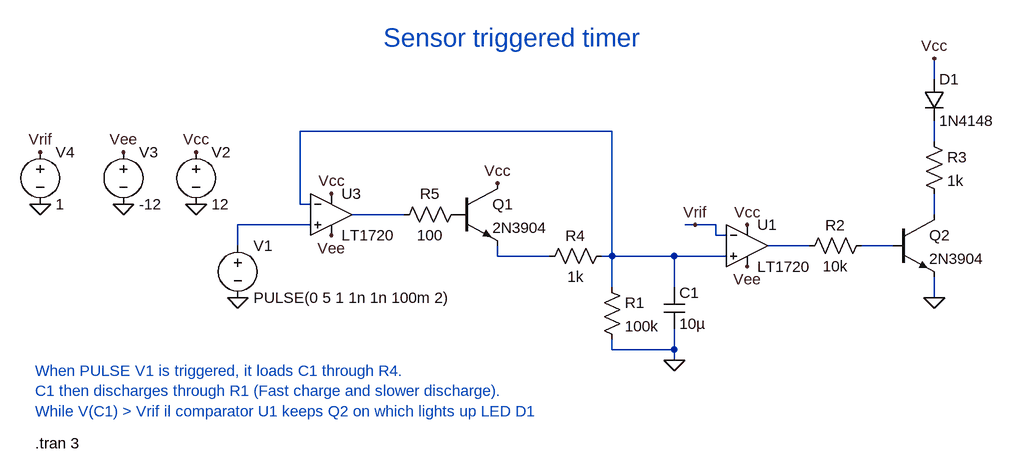
[diagram p0: schematic Sensor-triggered-timer-temporizzatore-1.asc]
Sensor-triggered-timer-temporizzatore-1.asc, the LTspice schematic file:
Version 4
SHEET 1 1152 680
WIRE 1056 -112 1056 -144
WIRE 560 -32 80 -32
WIRE 1056 -16 1056 -48
WIRE 80 80 80 -32
WIRE 96 80 80 80
WIRE 240 96 160 96
WIRE 1056 96 1056 64
WIRE 96 112 -16 112
WIRE 688 112 672 112
WIRE 720 112 688 112
WIRE 720 128 720 112
WIRE 736 128 720 128
WIRE -16 144 -16 112
WIRE 864 144 800 144
WIRE 992 144 944 144
WIRE 384 160 384 144
WIRE 464 160 384 160
WIRE 560 160 560 -32
WIRE 560 160 544 160
WIRE 656 160 560 160
WIRE 736 160 656 160
WIRE 560 208 560 160
WIRE 656 208 656 160
WIRE 1056 224 1056 192
WIRE 560 304 560 288
WIRE 656 304 656 272
WIRE 656 304 560 304
WIRE 656 320 656 304
FLAG 656 320 0
FLAG -16 224 0
FLAG -80 80 0
FLAG -80 0 Vcc
FLAG 128 64 Vcc
FLAG 384 48 Vcc
FLAG 768 112 Vcc
FLAG 1056 224 0
FLAG 1056 -144 Vcc
FLAG -192 80 0
FLAG -192 0 Vee
FLAG 128 128 Vee
FLAG 768 176 Vee
FLAG -320 80 0
FLAG 688 112 Vrif
FLAG -320 0 Vrif
SYMBOL voltage -16 128 R0
WINDOW 123 0 0 Left 2
WINDOW 39 0 0 Left 2
SYMATTR InstName V1
SYMATTR Value PULSE(0 5 1 1n 1n 100m 2)
SYMBOL npn 320 48 R0
SYMATTR InstName Q1
SYMATTR Value 2N3904
SYMBOL res 544 192 R0
SYMATTR InstName R1
SYMATTR Value 100k
SYMBOL cap 640 208 R0
SYMATTR InstName C1
SYMATTR Value 10µ
SYMBOL voltage -80 -16 R0
WINDOW 123 0 0 Left 2
WINDOW 39 0 0 Left 2
SYMATTR InstName V2
SYMATTR Value 12
SYMBOL res 960 128 R90
WINDOW 0 0 56 VBottom 2
WINDOW 3 32 56 VTop 2
SYMATTR InstName R2
SYMATTR Value 10k
SYMBOL npn 992 96 R0
SYMATTR InstName Q2
SYMATTR Value 2N3904
SYMBOL res 1040 -32 R0
SYMATTR InstName R3
SYMATTR Value 1k
SYMBOL diode 1040 -112 R0
SYMATTR InstName D1
SYMATTR Value 1N4148
SYMBOL res 560 144 R90
WINDOW 0 0 56 VBottom 2
WINDOW 3 32 56 VTop 2
SYMATTR InstName R4
SYMATTR Value 1k
SYMBOL res 336 80 R90
WINDOW 0 0 56 VBottom 2
WINDOW 3 32 56 VTop 2
SYMATTR InstName R5
SYMATTR Value 100
SYMBOL Comparators\\LT1720 128 32 R0
SYMATTR InstName U3
SYMBOL voltage -192 -16 R0
WINDOW 123 0 0 Left 2
WINDOW 39 0 0 Left 2
SYMATTR InstName V3
SYMATTR Value -12
SYMBOL Comparators\\LT1720 768 80 R0
SYMATTR InstName U1
SYMBOL voltage -320 -16 R0
WINDOW 123 0 0 Left 2
WINDOW 39 0 0 Left 2
SYMATTR InstName V4
SYMATTR Value 1
TEXT -328 448 Left 2 !.tran 3
TEXT -328 336 Left 2 ;When PULSE V1 is triggered, it loads C1 through R4.\nC1 then discharges through R1 (Fast charge and slower discharge).\nWhile V(C1) > Vrif il comparator U1 keeps Q2 on which lights up LED D1
TEXT 208 -176 Left 4 ;Sensor triggered timer

The netlist it stands for:
* Sensor-triggered-timer-temporizzatore-1.asc
V1 N005 0 PULSE(0 5 1 1n 1n 100m 2)
Q1 Vcc P001 N008 0 2N3904
R1 N001 0 100k
C1 N001 0 10µ
V2 Vcc 0 12
R2 N007 N006 10k
Q2 N004 N007 0 0 2N3904
R3 N002 N004 1k
D1 Vcc N002 1N4148
R4 N001 N008 1k
R5 P001 N003 100
XU3 N005 N001 Vcc Vee N003 LT1720  ; pins In+ In- V+ V- OUT
V3 Vee 0 -12
XU1 N001 Vrif Vcc Vee N006 LT1720  ; pins In+ In- V+ V- OUT
V4 Vrif 0 1
.model D D
.lib standard.dio
.model NPN NPN
.model PNP PNP
.lib standard.bjt
.tran 3
* When PULSE V1 is triggered, it loads C1 through R4.
* C1 then discharges through R1 (Fast charge and slower discharge).
* While V(C1) > Vrif il comparator U1 keeps Q2 on which lights up LED D1
* Sensor triggered timer
.lib LT1720.sub
.backanno
.end